# EAGLE schematic micro_1.1 (EAGLE 9.6.2)
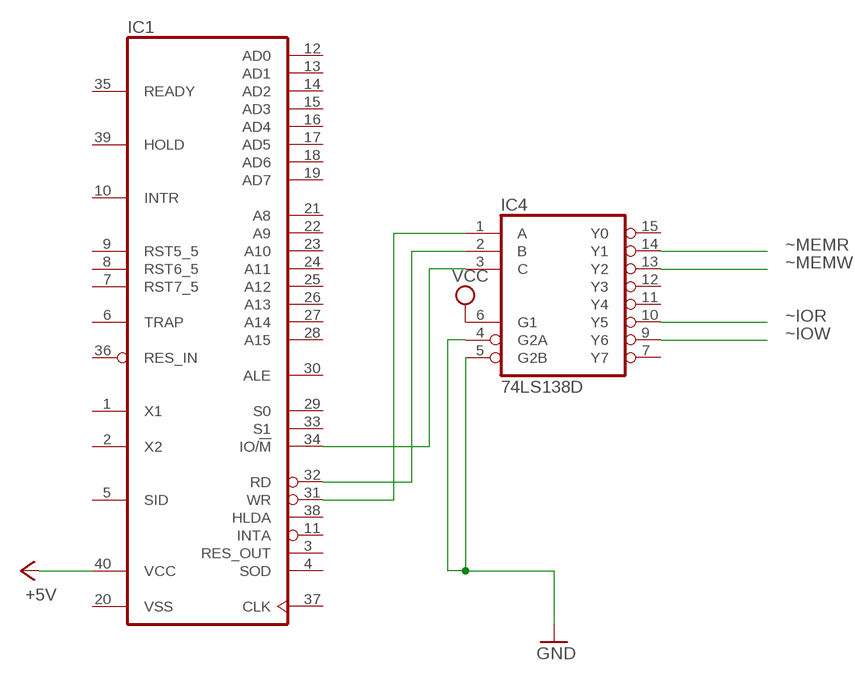
[diagram p0: schematic, sheet 1]

## Parts
IC1  8085  [DIL40]
IC4  74LS138D  [SO16]

## Nets
+5V: IC1.40(VCC)
GND: IC4.4(G2A) IC4.5(G2B)
N$1: IC1.31(WR) IC4.1(A)
N$2: IC1.32(RD) IC4.2(B)
N$3: IC1.34(IO/!M) IC4.3(C)
VCC: IC4.6(G1)
~IOR: IC4.10(Y5)
~IOW: IC4.9(Y6)
~MEMR: IC4.14(Y1)
~MEMW: IC4.13(Y2)
Unconnected: IC1.1(X1) IC1.2(X2) IC1.3(RES_OUT) IC1.4(SOD) IC1.5(SID) IC1.6(TRAP) IC1.7(RST7_5) IC1.8(RST6_5) IC1.9(RST5_5) IC1.10(INTR) IC1.11(INTA) IC1.12(AD0) IC1.13(AD1) IC1.14(AD2) IC1.15(AD3) IC1.16(AD4) IC1.17(AD5) IC1.18(AD6) IC1.19(AD7) IC1.21(A8) IC1.22(A9) IC1.23(A10) IC1.24(A11) IC1.25(A12) IC1.26(A13) IC1.27(A14) IC1.28(A15) IC1.29(S0) IC1.30(ALE) IC1.33(S1) IC1.35(READY) IC1.36(RES_IN) IC1.37(CLK) IC1.38(HLDA) IC1.39(HOLD) IC4.7(Y7) IC4.11(Y4) IC4.12(Y3) IC4.15(Y0)

## Power pins joined to a net without a drawn wire
GND: IC4.8(GND)
VCC: IC4.16(VCC)
VSS: IC1.20(VSS)

## Library data of the parts
IC1 = micro-intel:8085: MICROCOMPUTER/PERIPHERAL DEVICE; OC_FARNELL: unknown; OC_NEWARK: unknown
IC4 = 74xx-us:74*138: 3-line to 8-line DECODER/DEMULTIPLEXER